# EAGLE design power_supply (EAGLE 9.6.2)
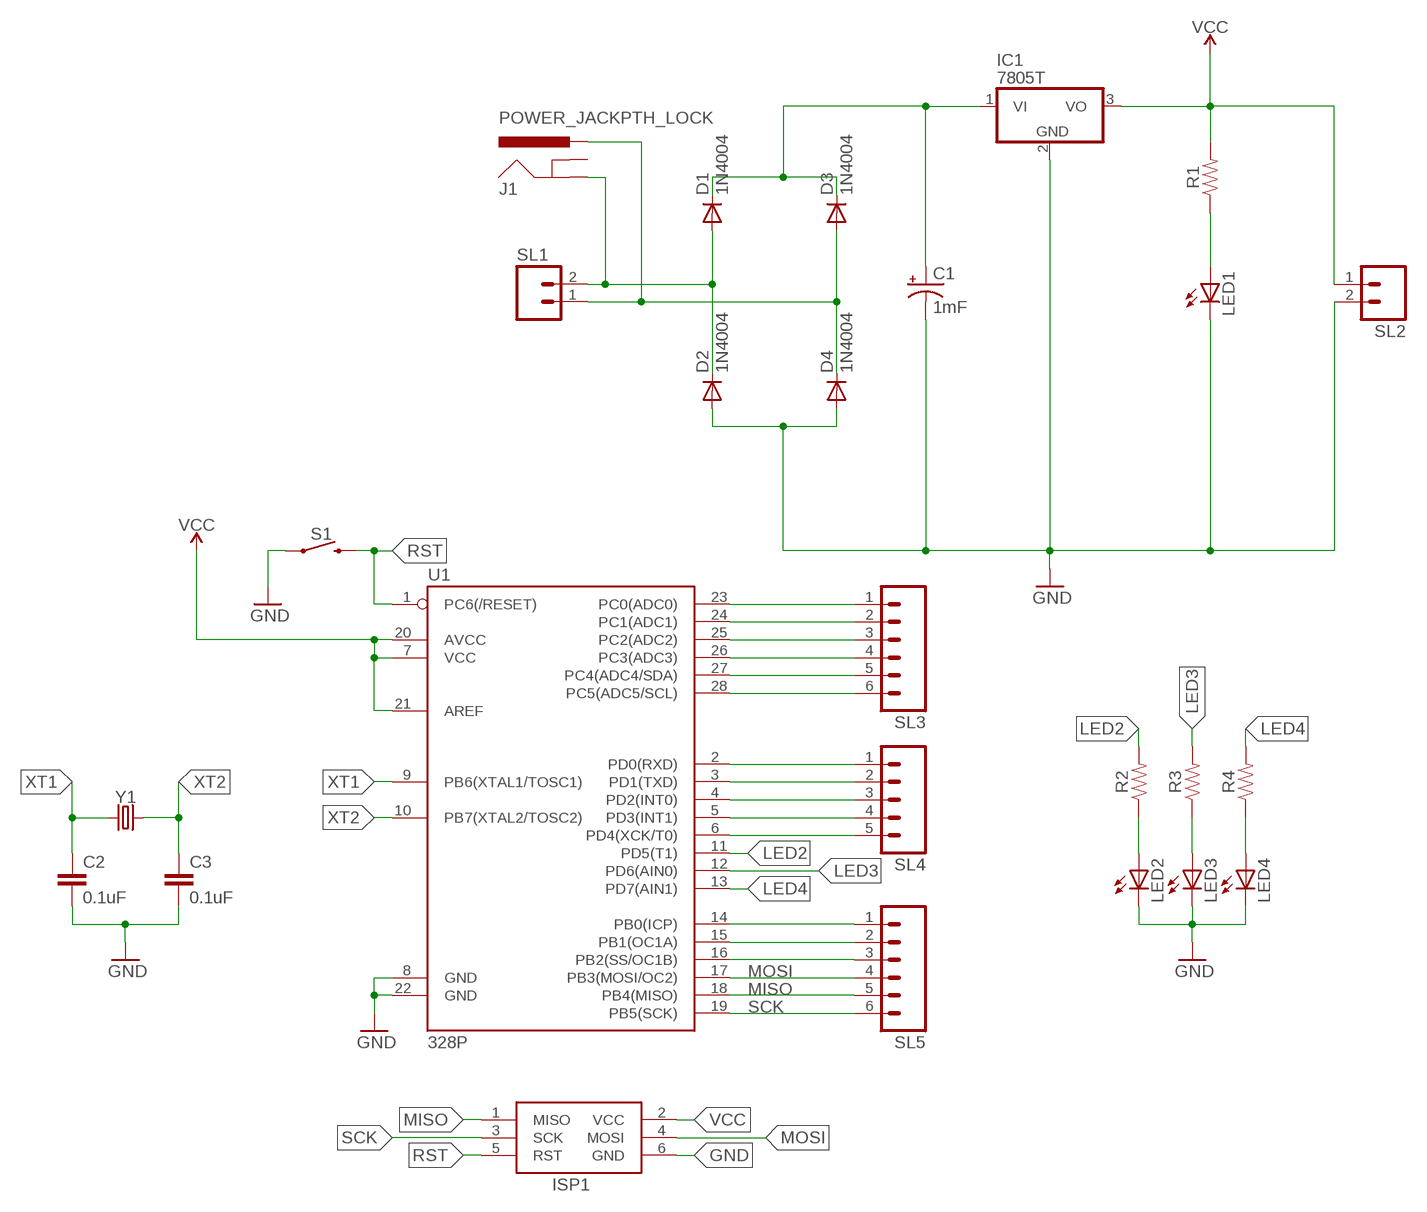
[diagram p0: schematic, sheet 1]

## Parts
C1  1mF  1000UF-RADIAL-5MM-25V-20%  [CPOL-RADIAL-5MM-10MM]
C2  0.1uF  0.1UF-KIT-EZ-50V-20%  [CAP-PTH-SMALL-KIT]
C3  0.1uF  0.1UF-KIT-EZ-50V-20%  [CAP-PTH-SMALL-KIT]
D1  1N4004  [DO41-10]
D2  1N4004  [DO41-10]
D3  1N4004  [DO41-10]
D4  1N4004  [DO41-10]
IC1  7805T  [TO220H]
ISP1  AVRISP-6  [AVRISP]
J1  POWER_JACKPTH_LOCK  [POWER_JACK_PTH_LOCK]
LED1  LED5MM  [LED5MM]
LED2  LED3MM  [LED3MM]
LED3  LED3MM  [LED3MM]
LED4  LED3MM  [LED3MM]
R1  RESISTORAXIAL-0.3  [AXIAL-0.3]
R2  RESISTORAXIAL-0.3  [AXIAL-0.3]
R3  RESISTORAXIAL-0.3  [AXIAL-0.3]
R4  RESISTORAXIAL-0.3  [AXIAL-0.3]
S1  MOMENTARY-SWITCH-SPST-PTH-6.0MM  [TACTILE_SWITCH_PTH_6.0MM]
SL1  M02  [02P]
SL2  M02  [02P]
SL3  M06  [06P]
SL4  M05  [05P]
SL5  M06  [06P]
U1  328P  ATMEGA328P_PDIP  [DIP28]
Y1  CRYSTALPTH-HC49US  [HC49US]

## Nets
GND: C1.- C2.2 C3.2 D2.A D4.A IC1.2(GND) ISP1.6(GND) LED1.K(C) LED2.K(C) LED3.K(C) LED4.K(C) S1.1 SL2.2 U1.8(GND) U1.22(GND)
LED2: R2.P$2 U1.11(PD5(T1))
LED3: R3.P$2 U1.12(PD6(AIN0))
LED4: R4.P$2 U1.13(PD7(AIN1))
MISO: ISP1.1(MISO) SL5.5 U1.18(PB4(MISO))
MOSI: ISP1.4(MOSI) SL5.4 U1.17(PB3(MOSI/OC2))
N$1: D1.A D2.C J1.GND SL1.2
N$3: D3.A D4.C J1.PWR SL1.1
N$4: C1.+ D1.C D3.C IC1.1(VI)
N$5: SL3.1 U1.23(PC0(ADC0))
N$6: LED1.A R1.P$1
N$7: LED2.A R2.P$1
N$8: LED3.A R3.P$1
N$9: LED4.A R4.P$1
N$10: SL3.2 U1.24(PC1(ADC1))
N$11: SL3.3 U1.25(PC2(ADC2))
N$12: SL3.4 U1.26(PC3(ADC3))
N$13: SL3.5 U1.27(PC4(ADC4/SDA))
N$14: SL3.6 U1.28(PC5(ADC5/SCL))
N$15: SL4.5 U1.6(PD4(XCK/T0))
N$16: SL4.4 U1.5(PD3(INT1))
N$17: SL4.3 U1.4(PD2(INT0))
N$18: SL4.2 U1.3(PD1(TXD))
N$19: SL4.1 U1.2(PD0(RXD))
N$20: SL5.1 U1.14(PB0(ICP))
N$21: SL5.2 U1.15(PB1(OC1A))
N$22: SL5.3 U1.16(PB2(SS/OC1B))
RST: ISP1.5(RST) S1.3 U1.1(PC6(/RESET))
SCK: ISP1.3(SCK) SL5.6 U1.19(PB5(SCK))
VCC: IC1.3(VO) ISP1.2(VCC) R1.P$2 SL2.1 U1.7(VCC) U1.20(AVCC) U1.21(AREF)
XT1: C2.1 U1.9(PB6(XTAL1/TOSC1)) Y1.1
XT2: C3.1 U1.10(PB7(XTAL2/TOSC2)) Y1.2
Unconnected: J1.GNDBREAK

## Library data of the parts
C1 = SparkFun-Capacitors:1000UF: 1,000µF/1mF ceramic capacitors A capacitor is a passive two-terminal electrical component used to store electrical energy temporarily in an electric field. CAP-08070; PROD_ID: CAP-09538
C2 C3 = SparkFun-Capacitors:0.1UF: 0.1µF ceramic capacitors A capacitor is a passive two-terminal electrical component used to store electrical energy temporarily in an electric field.; PROD_ID: CAP-08370
D1-D4 = adafruit:1N4004: DIODE General purpose 1N400x type rectifier (With bigger pads) http://www.ladyada.net/library/pcb/eaglelibrary.html
IC1 = adafruit:78*: Positive VOLTAGE REGULATOR Added bigger pads to the TO-92 package
ISP1 = adafruit:AVRISP: AVR ISP HEADER Standard 6 pin header for AVR programming
J1 = SparkFun-Connectors:POWER_JACK: Power Jack Connector This is the standard 5.5mm barrel jack for power. The PTH is the most common, proven, reliable, footprint. The Slot footprint only works if the mill layer is transmitted to the PCB fab house so be warned. Here are the connectors we sell at SparkFun: DC Barrel Power Jack/Connector <https://www.sparkfun.com/products/119> (PRT-00119) DC Barrel Power Jack/Connector (SMD) <https://www.sparkfun.com/products/12748> (PRT-12748) DC Barrel Jack Adapter - Breadboard Compatible <https://www.sparkfun.com/products/10811> (PRT-10811) It is used on this SparkFun product (and many, many others): SparkFun RedBoard - Programmed with Arduino <https://www.sparkfun.com/products/12757> (DEV-12757) Also, if you need a mating power supply or connector, please check these out: Wall Adapter Power Supply - 9VDC 650mA <https://www.sparkfun.com/products/298> (TOL-00298) DC Barrel Jack Adapter - Male <https://www.sparkfun.com/products/10287> (PRT-10287); PROD_ID: CONN-08197; SF_ID: PRT-00119
LED1-LED4 = adafruit:LED: LED OSRAM: - CHIPLED LG R971, LG N971, LY N971, LG Q971, LY Q971, LO R971, LY R971 LH N974, LH R974 LS Q976, LO Q976, LY Q976 LO Q996 - Hyper CHIPLED LW Q18S LB Q993, LB Q99A, LB R99A - SideLED LS A670, LO A670, LY A670, LG A670, LP A670 LB A673, LV A673, LT A673, LW A673 LH A674 LY A675 LS A676, LA A676, LO A676, LY A676, LW A676 LS A679, LY A679, LG A679 - Hyper Micro SIDELED® LS Y876, LA Y876, LO Y876, LY Y876 LT Y87S - SmartLED LW L88C, LW L88S LB L89C, LB L89S, LG L890 LS L89K, LO L89K, LY L89K LS L896, LA L896, LO L896, LY L896 - TOPLED LS T670, LO T670, LY T670, LG T670, LP T670 LSG T670, LSP T670, LSY T670, LOP T670, LYG T670 LG T671, LOG T671, LSG T671 LB T673, LV T673, LT T673, LW T673 LH T674 LS T676, LA T676, LO T676, LY T676, LB T676, LH T676, LSB T676, LW T676 LB T67C, LV T67C, LT T67C, LS T67K, LO T67K, LY T67K, LW E67C LS E67B, LA E67B, LO E67B, LY E67B, LB E67C, LV E67C, LT E67C LW T67C LS T679, LY T679, LG T679 LS T770, LO T770, LY T770, LG T770, LP T770 LB T773, LV T773, LT T773, LW T773 LH T774 LS E675, LA E675, LY E675, LS T675 LS T776, LA T776, LO T776, LY T776, LB T776 LHGB T686 LT T68C, LB T68C - Hyper Mini TOPLED® LB M676 - Mini TOPLED Santana® LG M470 LS M47K, LO M47K, LY M47K Source: http://www.osram.convergy.de/
R1-R4 = SparkFun-Resistors:RESISTOR: Generic Resistor Package
S1 = SparkFun-Switches:MOMENTARY-SWITCH-SPST: Momentary Switch (Pushbutton) - SPST Normally-open (NO) SPST momentary switches (buttons, pushbuttons). Variants PTH-12MM - 12mm square, through-hole Momentary Pushbutton Switch - 12mm Square <https://www.sparkfun.com/products/9190> (COM-09190) PTH-6.0MM, PTH-6.0MM-KIT - 6.0mm square, through-hole Mini Pushbutton Switch <https://www.sparkfun.com/products/97> (COM-00097) KIT package intended for soldering kit's - only one side of pads' copper is exposed. PTH-RIGHT-ANGLE-KIT - Right-angle, through-hole Right Angle Tactile Button <https://www.sparkfun.com/products/10791> - Used on SparkFun BigTime Watch Kit <https://www.sparkfun.com/products/11734> SMD-12MM - 12mm square, surface-mount Tactile Button - SMD (12mm) <https://www.sparkfun.com/products/12993> (COM-12993) Used on SparkFun PicoBoard <https://www.sparkfun.com/products/11888> SMD-4.5MM - 4.5mm Square Trackball Switch Used on SparkFun Blackberry Trackballer Breakout <https://www.sparkfun.com/products/13169> SMD-4.6MMX2.8MM - 4.60mm x 2.80mm, surface mount Used on SparkFun SAMD21 Mini Breakout <https://www.sparkfun.com/products/13664> SMD-5.2MM, SMD-5.2-REDUNDANT - 5.2mm square, surface-mount Mini Pushbutton Switch - SMD <https://www.sparkfun.com/products/8720> (COM-08720) Used on Arduino Pro Mini <https://www.sparkfun.com/products/11114> REDUNDANT package connects both switch circuits together SMD-6.0X3.5MM - 6.0 x 3.5mm, surface mount Momentary Reset Switch SMD <https://www.sparkfun.com/products/8229> (COM-08229) SMD-6.2MM-TALL - 6.2mm square, surface mount Tactile Button - SMD (6mm) <https://www.sparkfun.com/products/12992> Used on SparkFun Digital Sandbox <https://www.sparkfun.com/products/12651> SMD-RIGHT-ANGLE - Right-angle, surface mount Used on SparkFun Block for Intel® Edison - Arduino <https://www.sparkfun.com/products/13036>; PROD_ID: SWCH-08441; SF_SKU: COM-00097
SL1 SL2 = con-amp-quick:M02: AMP QUICK CONNECTOR; OC_FARNELL: unknown; OC_NEWARK: unknown
SL3 SL5 = con-amp-quick:M06: AMP QUICK CONNECTOR; OC_FARNELL: unknown; OC_NEWARK: unknown
SL4 = con-amp-quick:M05: AMP QUICK CONNECTOR; OC_FARNELL: unknown; OC_NEWARK: unknown
U1 = SparkFun-IC-Microcontroller:ATMEGA328P_PDIP: Atmel 328P Through hole ATMEGA328P uC used in the Arduino 32kb flash, 1k EEPROM, 2k SRAM Datasheet <http://www.sparkfun.com/datasheets/Components/SMD/ATMega328.pdf> SparkFun Products Storefront component: AVR 28 Pin 20MHz 32K 6A/D - ATMega328P <https://www.sparkfun.com/products/9061> (COM-09061) SparkFun Simon Says - Through-Hole Soldering Kit <https://www.sparkfun.com/products/10547> (KIT-10547) SparkFun Learn to Solder - Simon Says <https://www.sparkfun.com/products/13708> (KIT-13708) SparkFun BigTime Watch Kit <https://www.sparkfun.com/products/11734> (KIT-11734) SparkFun ClockIt <https://www.sparkfun.com/products/10930> (KIT-10930) SparkFun Serial Enabled LCD Kit <https://www.sparkfun.com/products/10097> (LCD-10097) SparkFun Simon Tilts - Through Hole Soldering Kit <https://www.sparkfun.com/products/12634> (KIT-12634) SparkFun Frequency Counter Kit <https://www.sparkfun.com/products/10140> (KIT-10140) FabFM Radio Kit <https://www.sparkfun.com/products/11043> (KIT-11043) SparkFun Binary Blaster Kit <https://www.sparkfun.com/products/12037> (KIT-12037) SparkFun Metro-Gnome <https://www.sparkfun.com/products/9236> (KIT-09236) ATmega328 with Arduino Optiboot (Uno) <https://www.sparkfun.com/products/10524> (DEV-10524); PROD_ID: IC-09136
Y1 = SparkFun-Clocks:CRYSTAL: Crystals (Generic) These are passive quartz crystals, which can be used as a clock source for a microcontroller. Crystal's are two-terminal devices. They require external "load" capacitors to generate an oscillating signal.

## Board
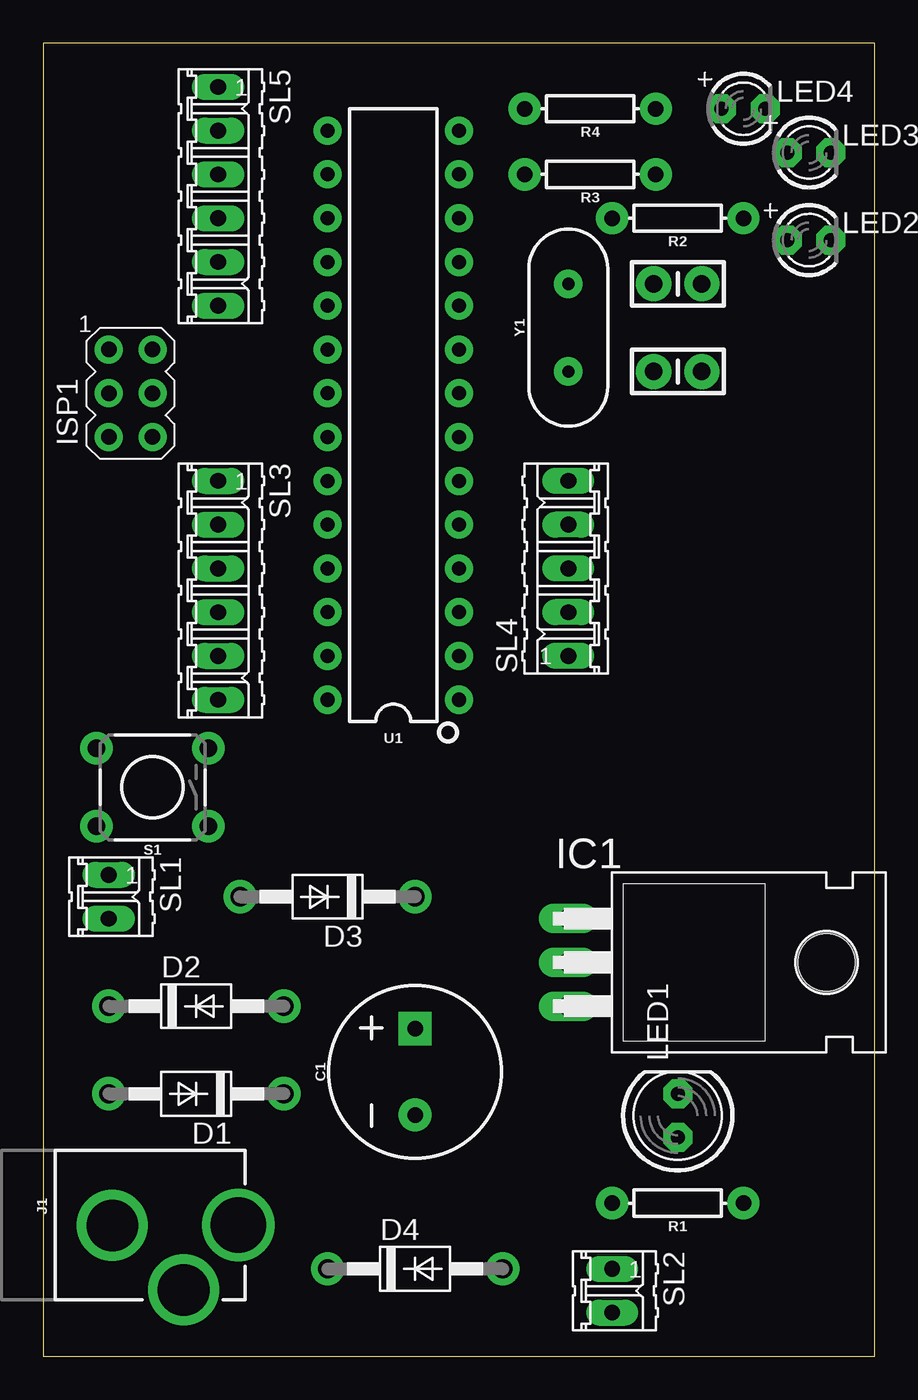
[diagram p1: board, top side]
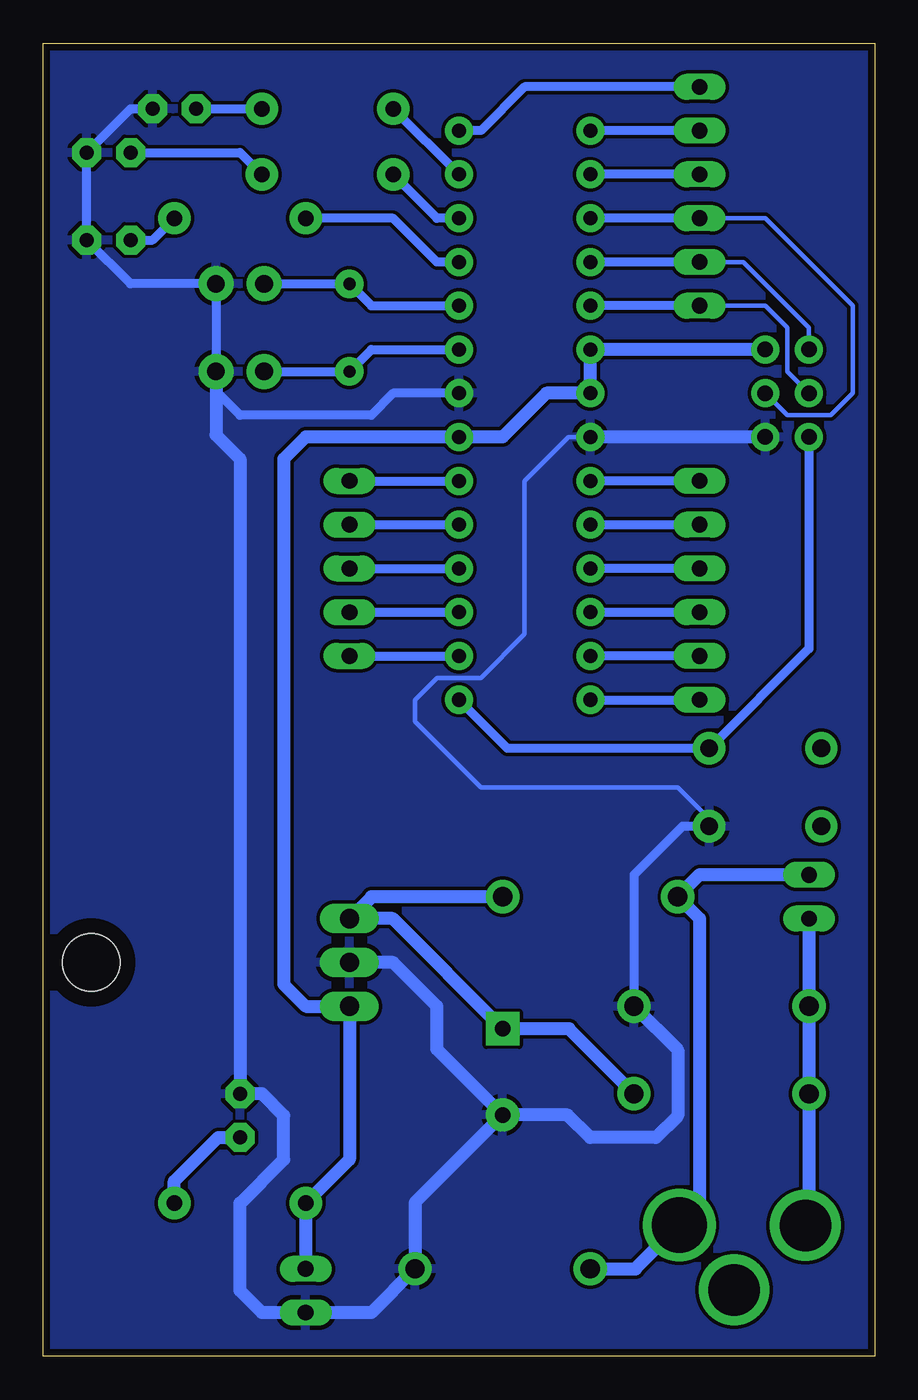
[diagram p2: board, bottom side, seen from below]

Size 48.26 x 76.2 mm. Coordinates in mm from the lower left corner, seen from the top.
Outline: 0,0 48.26,0 48.26,76.2 0,76.19 0,0
Copper layers (1*16): Top 0.035mm / dielectric 1.5mm / Bottom 0.035mm
Design rules "default *": minimum track width 0.25mm, minimum drill 0.35mm, track to track 0.2mm, track to pad 0.2mm, pad to pad 0.5mm, via to via 0.3mm, smd to smd 6mil, copper to edge 0.4mm, drill to drill 6mil, minimum pad ring 0.3mm, minimum via ring 0.3mm, stop-mask expansion 0.07mm, vias tented up to drill 0mil, thermal gap 10mil

### Footprints (pad centres in the part's own frame; a part is rotated, then mirrored left to right if it is on the bottom)
CPOL-RADIAL-5MM-10MM = drill 0.9 pad 1.93 square: + 2.5,0 | drill 0.9 pad 1.93: - -2.5,0
CAP-PTH-SMALL-KIT = drill 1.016 pad 2.032: 1 -1.397,0; 2 1.397,0
DO41-10 = drill 1.118 pad 1.93: A 5.08,0; C -5.08,0
TO220H = drill 1.118 long: 1 -2.54,-10.16; 2 0,-10.16; 3 2.54,-10.16 | hole 3.302: 0,4.826
AVRISP = drill 0.9 pad 1.626: 1 -1.27,2.54; 2 1.27,2.54; 3 -1.27,0; 4 1.27,0; 5 -1.27,-2.54; 6 1.27,-2.54
POWER_JACK_PTH_LOCK = drill 2.997 pad 4.115: GND 0.025,6.557; GNDBREAK 3.762,10.7 | drill 3.2 pad 4.115: PWR 0,13.878
LED5MM = drill 0.813 pad 1.676 octagon: A -1.27,0; K 1.27,0
LED3MM = drill 0.813 pad 1.676 octagon: A -1.27,0; K 1.27,0
AXIAL-0.3 = drill 0.9 pad 1.88: P$1 -3.81,0; P$2 3.81,0
TACTILE_SWITCH_PTH_6.0MM = drill 1.016 pad 1.88: 1 -3.251,2.261; 2 3.251,2.261; 3 -3.251,-2.261; 4 3.251,-2.261
02P = drill 0.914 long: 1 -1.27,0; 2 1.27,0
06P = drill 0.914 long: 1 -6.35,0; 2 -3.81,0; 3 -1.27,0; 4 1.27,0; 5 3.81,0; 6 6.35,0
05P = drill 0.914 long: 1 -5.08,0; 2 -2.54,0; 3 0,0; 4 2.54,0; 5 5.08,0
DIP28 = drill 0.813 pad 1.626: 1 -16.51,-3.81; 2 -13.97,-3.81; 3 -11.43,-3.81; 4 -8.89,-3.81; 5 -6.35,-3.81; 6 -3.81,-3.81; 7 -1.27,-3.81; 8 1.27,-3.81; 9 3.81,-3.81; 10 6.35,-3.81; 11 8.89,-3.81; 12 11.43,-3.81; 13 13.97,-3.81; 14 16.51,-3.81; 15 16.51,3.81; 16 13.97,3.81; 17 11.43,3.81; 18 8.89,3.81; 19 6.35,3.81; 20 3.81,3.81; 21 1.27,3.81; 22 -1.27,3.81; 23 -3.81,3.81; 24 -6.35,3.81; 25 -8.89,3.81; 26 -11.43,3.81; 27 -13.97,3.81; 28 -16.51,3.81
HC49US = drill 0.7 pad 1.651: 1 -2.54,0; 2 2.54,0

### Placement (x,y rotation side)
C1  21.59,16.51 90 top
C2  36.83,57.15 0 top
C3  36.83,62.23 0 top
D1  8.89,15.24 180 top
D2  8.89,20.32 0 top
D3  16.51,26.67 180 top
D4  21.59,5.08 0 top
IC1  40.64,22.86 270 top
ISP1  5.08,55.88 0 top
J1  -2.54,7.62 270 top
LED1  36.83,13.97 90 top
LED2  44.45,64.77 0 top
LED3  44.45,69.85 0 top
LED4  40.64,72.39 0 top
R1  36.83,8.89 180 top
R2  36.83,66.04 180 top
R3  31.75,68.58 180 top
R4  31.75,72.39 180 top
S1  6.35,33.02 180 top
SL1  3.81,26.67 270 top
SL2  33.02,3.81 270 top
SL3  10.16,44.45 270 top
SL4  30.48,45.72 90 top
SL5  10.16,67.31 270 top
U1  20.32,54.61 90 top
Y1  30.48,59.69 90 top

### Tracks (layer width: path | path; a pad name or v marks a point on that pad's centre or on a via)
GND
  Bottom 0.254: U1.22 17.78,53.34 20.32,50.8 20.32,41.91 22.86,39.37 25.4,39.37 26.67,38.1 26.67,36.83 22.86,33.02 11.43,33.02 9.6,31.19 S1.1
  Bottom 0.508: LED4.K 43.18,72.39 LED3.K LED2.K 43.18,62.23 C3.2 C2.2 38.23,56.01 36.83,54.61 29.21,54.61 27.94,55.88 U1.8 | S1.1 11.15,30.76 13.97,27.94 D2.A
  Bottom 0.762: C1.- 26.67,8.93 D4.A 29.21,2.54 SL2.2 35.56,2.54 36.83,3.81 36.83,8.89 34.29,11.43 34.29,13.97 35.56,15.24 LED1.K 36.83,52.07 38.23,53.47 C2.2 | C1.- 17.82,14.01 16.51,12.7 12.7,12.7 11.43,13.97 11.43,17.78 D2.A | C1.- 25.4,17.82 25.4,20.32 27.94,22.86 IC1.2 | ISP1.6 U1.22
  pour Bottom: 48.26,76.2 48.26,0 0,0 0,76.2
LED2
  Bottom 0.508: U1.11 25.4,63.5 27.94,66.04 R2.P$2
LED3
  Bottom 0.508: U1.12 25.4,66.04 R3.P$2
LED4
  Bottom 0.508: U1.13 R4.P$2
MISO
  Bottom 0.254: ISP1.1 3.81,59.69 7.62,63.5 SL5.5
  Bottom 0.508: SL5.5 U1.18
MOSI
  Bottom 0.254: ISP1.4 5.08,54.61 2.54,54.61 1.27,55.88 1.27,60.96 6.35,66.04 SL5.4
  Bottom 0.508: SL5.4 U1.17
N$1
  Bottom 0.762: SL1.2 D2.C D1.A 3.81,7.8 J1.GND
N$3
  Bottom 0.762: SL1.1 10.16,27.94 D3.A 10.16,25.4 10.16,8.8 J1.PWR 13.88,5.08 D4.C
N$4
  Bottom 0.762: D1.C 17.74,19.01 C1.+ 27.98,25.4 IC1.1 29.21,26.67 D3.C
N$5
  Bottom 0.508: SL3.1 U1.23
N$6
  Bottom 0.762: R1.P$1 40.64,10.16 38.1,12.7 LED1.A
N$7
  Bottom 0.508: R2.P$1 41.91,64.77 LED2.A
N$8
  Bottom 0.508: LED3.A 36.83,69.85 R3.P$1
N$9
  Bottom 0.508: LED4.A R4.P$1
N$10
  Bottom 0.508: U1.24 SL3.2
N$11
  Bottom 0.508: SL3.3 U1.25
N$12
  Bottom 0.508: U1.26 SL3.4
N$13
  Bottom 0.508: SL3.5 U1.27
N$14
  Bottom 0.508: U1.28 SL3.6
N$15
  Bottom 0.508: SL4.5 U1.6
N$16
  Bottom 0.508: SL4.4 U1.5
N$17
  Bottom 0.508: SL4.3 U1.4
N$18
  Bottom 0.508: SL4.2 U1.3
N$19
  Bottom 0.508: SL4.1 U1.2
N$20
  Bottom 0.508: SL5.1 20.32,73.66 22.86,71.12 U1.14
N$21
  Bottom 0.508: SL5.2 U1.15
N$22
  Bottom 0.508: SL5.3 U1.16
RST
  Bottom 0.508: U1.1 21.31,35.28 S1.3 3.81,41.07 ISP1.5
SCK
  Bottom 0.254: ISP1.3 5.08,57.15 5.08,59.69 6.35,60.96 SL5.6
  Bottom 0.508: SL5.6 U1.19
VCC
  Bottom 0.762: SL2.1 R1.P$2 30.48,11.43 IC1.3 33.02,20.32 34.29,21.59 34.29,52.07 33.02,53.34 U1.7 21.59,53.34 19.05,55.88 U1.21 U1.20 ISP1.2
XT1
  Bottom 0.508: C2.1 Y1.1 29.21,58.42 U1.9
XT2
  Bottom 0.508: C3.1 Y1.2 29.21,60.96 U1.10